# EAGLE design SHIEL_V1.0 (EAGLE 9.6.2)

## Sheet 1 of 2
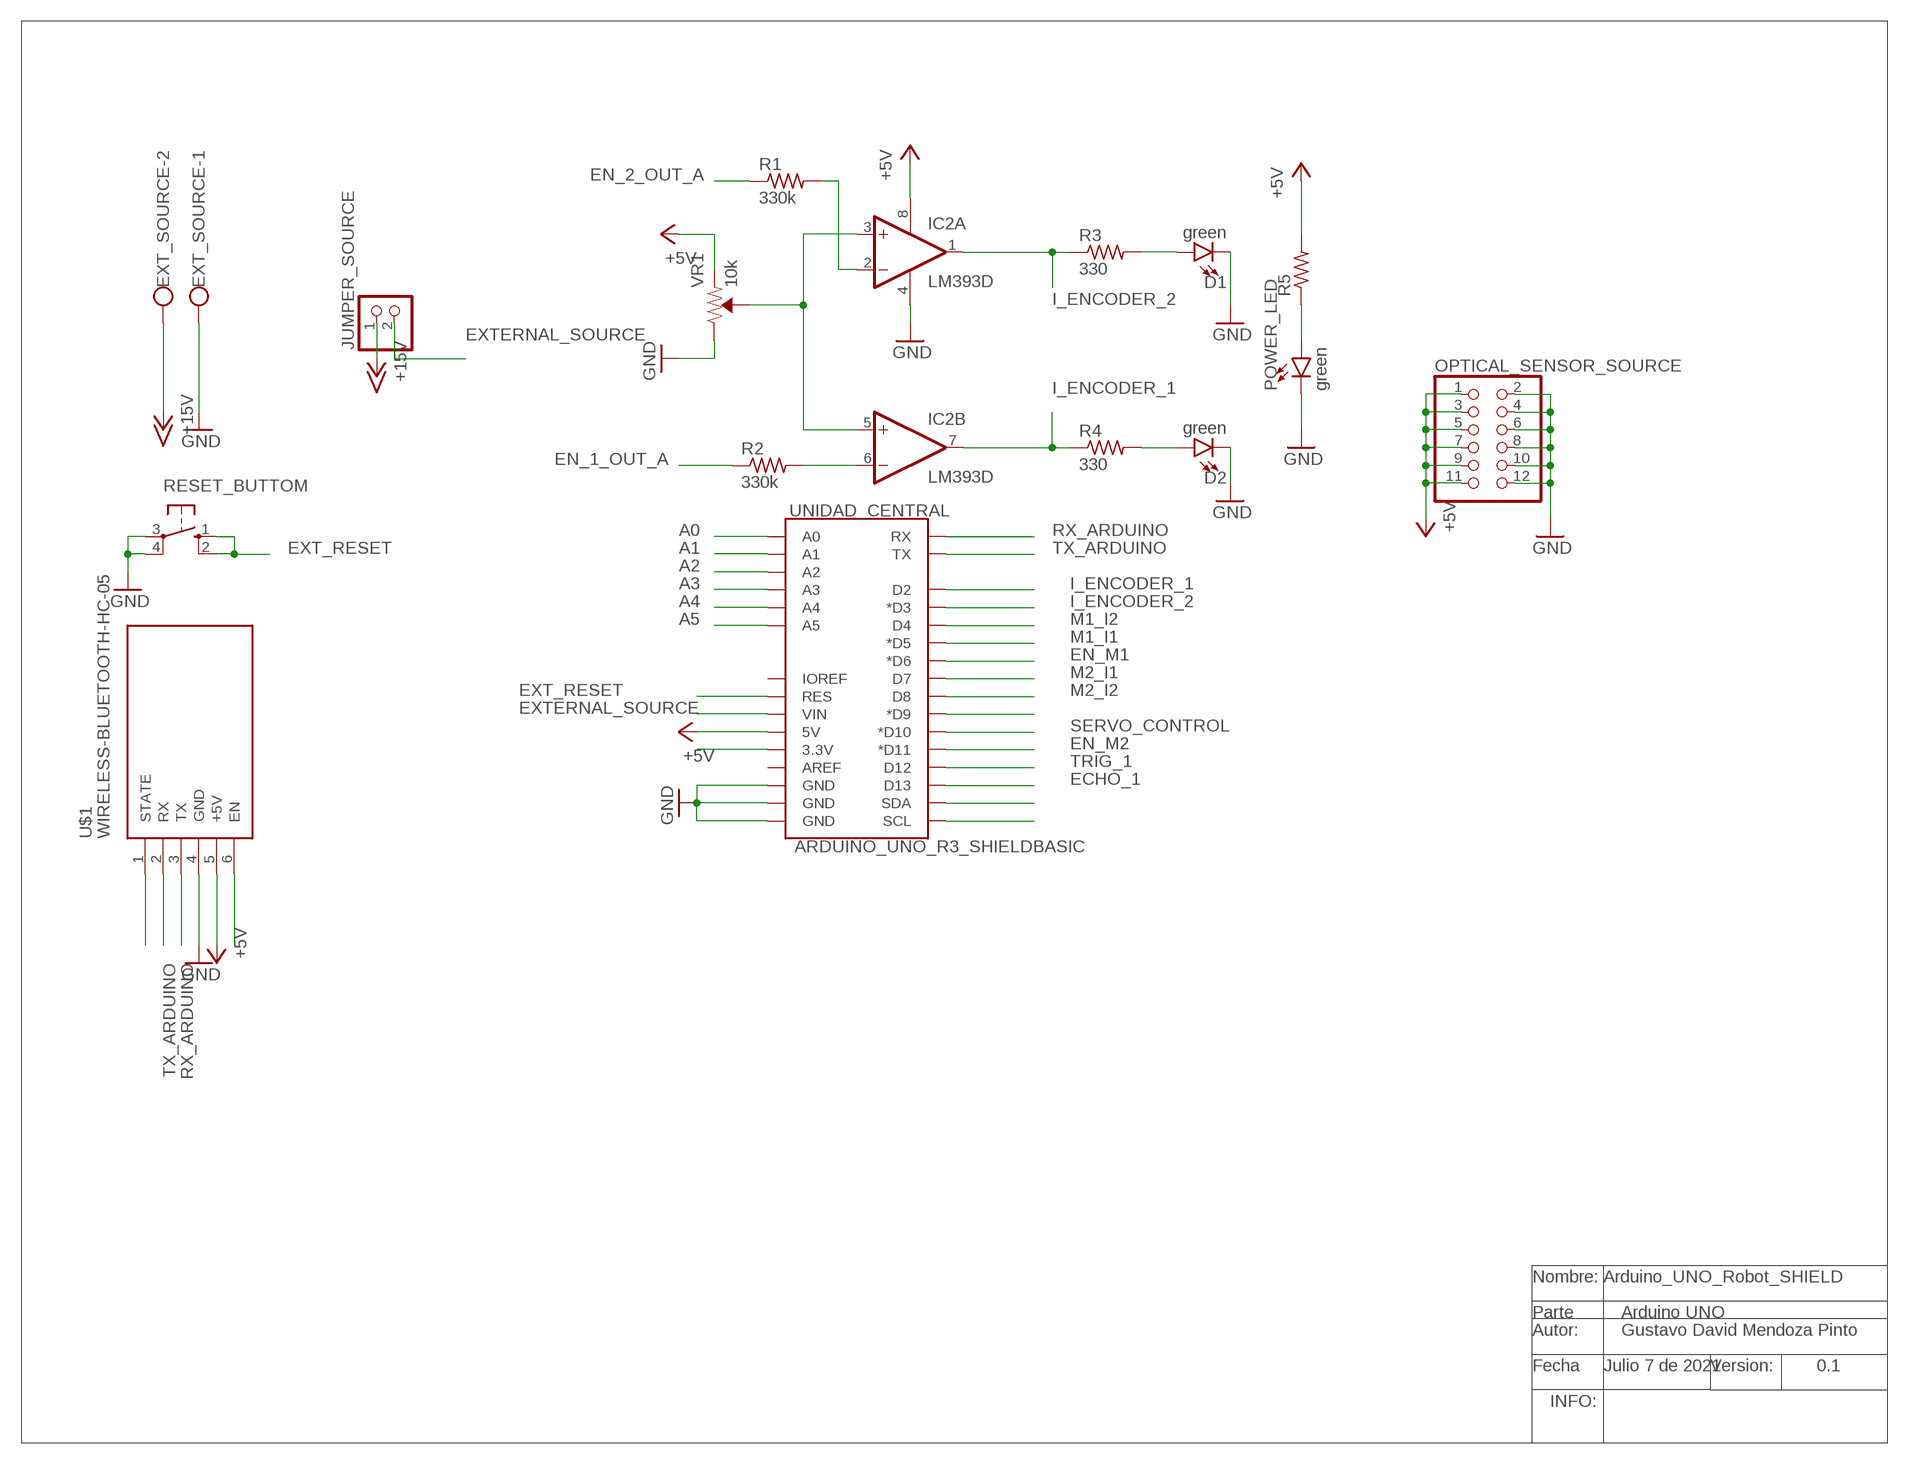
[diagram p0: schematic, sheet 1]

### Parts
D1  green  LED-3MM-NO_SILK  [LED_3MM-NS]
D2  green  LED-3MM-NO_SILK  [LED_3MM-NS]
EXT_SOURCE  W237-102  [W237-102]
IC2  LM393D  [SO08]
JUMPER_SOURCE  PINHD-1X2  [1X02]
OPTICAL_SENSOR_SOURCE  PINHD-2X6  [2X06]
POWER_LED  green  LED-3MM-NO_SILK  [LED_3MM-NS]
R1  330k  R-US_M2012  [M2012]
R2  330k  R-US_M2012  [M2012]
R3  330  R-US_M2012  [M2012]
R4  330  R-US_M2012  [M2012]
R5  R-US_M2012  [M2012]
RESET_BUTTOM  10-XX  [B3F-10XX]
U$1  WIRELESS-BLUETOOTH-HC-05  [WIRELESS-BLUETOOTH-HC-05]
UNIDAD_CENTRAL  ARDUINO_UNO_R3_SHIELDBASIC  [UNO_R3_SHIELD]
VR1  10k  TRIMPOT-PTH-10MM-KNOB-1/2W-10%  [TRIMPOT-PTH-3386U]

### Nets
+5V: IC2.8(P:V+) OPTICAL_SENSOR_SOURCE.1 OPTICAL_SENSOR_SOURCE.3 OPTICAL_SENSOR_SOURCE.5 OPTICAL_SENSOR_SOURCE.7 OPTICAL_SENSOR_SOURCE.9 OPTICAL_SENSOR_SOURCE.11 R5.2 U$1.5(+5V) UNIDAD_CENTRAL.5V VR1.1(CCW) ; also sheet 2
+15V: EXT_SOURCE.2 JUMPER_SOURCE.1
A0: UNIDAD_CENTRAL.A0 ; also sheet 2
A1: UNIDAD_CENTRAL.A1 ; also sheet 2
A2: UNIDAD_CENTRAL.A2 ; also sheet 2
A3: UNIDAD_CENTRAL.A3 ; also sheet 2
A4: UNIDAD_CENTRAL.A4 ; also sheet 2
A5: UNIDAD_CENTRAL.A5 ; also sheet 2
ECHO_1: UNIDAD_CENTRAL.D13 ; also sheet 2
EN_1_OUT_A: R2.1 ; also sheet 2
EN_2_OUT_A: R1.1 ; also sheet 2
EN_M1: UNIDAD_CENTRAL.D6(*D6) ; also sheet 2
EN_M2: UNIDAD_CENTRAL.D11(*D11) ; also sheet 2
EXT_RESET: RESET_BUTTOM.1(S) RESET_BUTTOM.2(S1) UNIDAD_CENTRAL.RES
EXTERNAL_SOURCE: JUMPER_SOURCE.2 UNIDAD_CENTRAL.VIN ; also sheet 2
GND: D1.K(C) D2.K(C) EXT_SOURCE.1 IC2.4(P:V-) OPTICAL_SENSOR_SOURCE.2 OPTICAL_SENSOR_SOURCE.4 OPTICAL_SENSOR_SOURCE.6 OPTICAL_SENSOR_SOURCE.8 OPTICAL_SENSOR_SOURCE.10 OPTICAL_SENSOR_SOURCE.12 POWER_LED.K(C) RESET_BUTTOM.3(P) RESET_BUTTOM.4(P1) U$1.4(GND) UNIDAD_CENTRAL.GND@0(GND) UNIDAD_CENTRAL.GND@1(GND) UNIDAD_CENTRAL.GND@2(GND) VR1.3(CW) ; also sheet 2
I_ENCODER_1: IC2.7(B:OUT) R4.1 UNIDAD_CENTRAL.D2 ; also sheet 2
I_ENCODER_2: IC2.1(A:OUT) R3.1 UNIDAD_CENTRAL.D3(*D3) ; also sheet 2
M1_I1: UNIDAD_CENTRAL.D5(*D5) ; also sheet 2
M1_I2: UNIDAD_CENTRAL.D4 ; also sheet 2
M2_I1: UNIDAD_CENTRAL.D7 ; also sheet 2
M2_I2: UNIDAD_CENTRAL.D8 ; also sheet 2
N$1: U$1.6(EN)
N$3: IC2.3(A:+IN) IC2.5(B:+IN) VR1.2(WIPER)
N$4: U$1.1(STATE)
N$5: UNIDAD_CENTRAL.D9(*D9)
N$6: IC2.2(A:-IN) R1.2
N$8: IC2.6(B:-IN) R2.2
N$10: POWER_LED.A R5.1
N$12: D1.A R3.2
N$13: D2.A R4.2
N$15: UNIDAD_CENTRAL.SDA
N$16: UNIDAD_CENTRAL.SCL
N$20: UNIDAD_CENTRAL.3.3V
RX_ARDUINO: U$1.3(TX) UNIDAD_CENTRAL.RX
SERVO_CONTROL: UNIDAD_CENTRAL.D10(*D10) ; also sheet 2
TRIG_1: UNIDAD_CENTRAL.D12 ; also sheet 2
TX_ARDUINO: U$1.2(RX) UNIDAD_CENTRAL.TX
Unconnected: UNIDAD_CENTRAL.AREF UNIDAD_CENTRAL.IOREF

### Notes on the sheet
- Nombre: Arduino_UNO_Robot_SHIELD
- Parte | Arduino UNO
- Autor: | Gustavo David Mendoza Pinto
- Fecha | Julio 7 de 2021 | Version: | 0.1
- INFO:

## Sheet 2 of 2
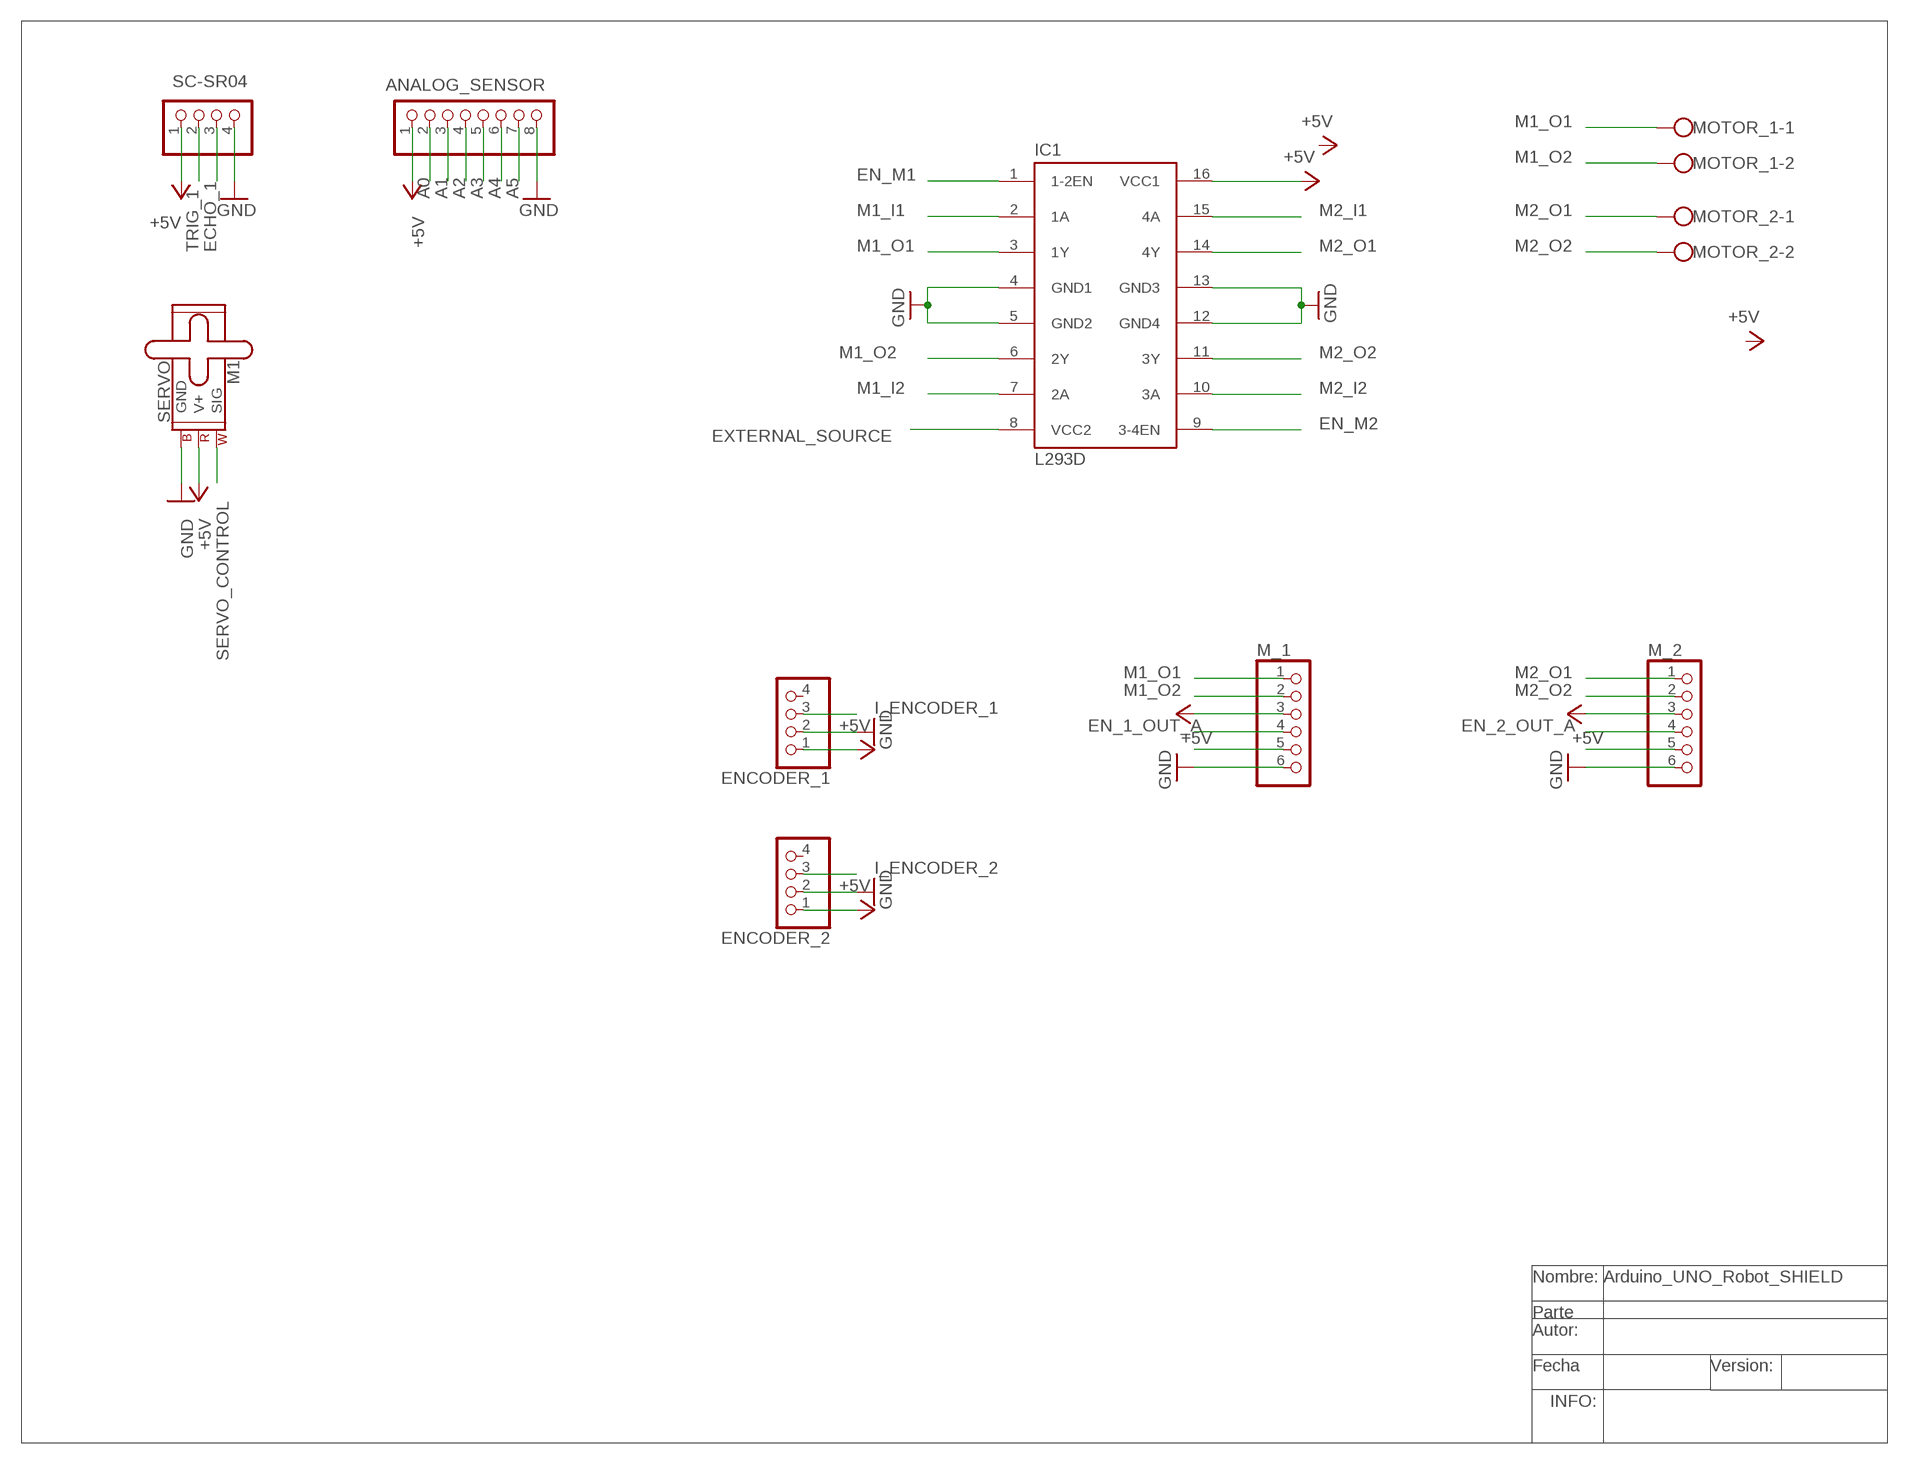
[diagram p1: schematic, sheet 2]

### Parts
ANALOG_SENSOR  PINHD-1X8  [1X08]
ENCODER_1  PINHD-1X4  [1X04]
ENCODER_2  PINHD-1X4  [1X04]
IC1  L293D  [DIL16]
M1  SERVO  [1X03]
M_1  PINHD-1X6  [1X06]
M_2  PINHD-1X6  [1X06]
MOTOR_1  W237-102  [W237-102]
MOTOR_2  W237-102  [W237-102]
SC-SR04  PINHD-1X4  [1X04]

### Nets
+5V: ANALOG_SENSOR.1 ENCODER_1.1 ENCODER_2.1 IC1.16(VCC1) M1.2(V+) M_1.3 M_2.3 SC-SR04.1 ; also sheet 1
A0: ANALOG_SENSOR.2 ; also sheet 1
A1: ANALOG_SENSOR.3 ; also sheet 1
A2: ANALOG_SENSOR.4 ; also sheet 1
A3: ANALOG_SENSOR.5 ; also sheet 1
A4: ANALOG_SENSOR.6 ; also sheet 1
A5: ANALOG_SENSOR.7 ; also sheet 1
ECHO_1: SC-SR04.3 ; also sheet 1
EN_1_OUT_A: M_1.4 ; also sheet 1
EN_2_OUT_A: M_2.4 ; also sheet 1
EN_M1: IC1.1(1-2EN) ; also sheet 1
EN_M2: IC1.9(3-4EN) ; also sheet 1
EXTERNAL_SOURCE: IC1.8(VCC2) ; also sheet 1
GND: ANALOG_SENSOR.8 ENCODER_1.2 ENCODER_2.2 IC1.4(GND1) IC1.5(GND2) IC1.12(GND4) IC1.13(GND3) M1.3(GND) M_1.6 M_2.6 SC-SR04.4 ; also sheet 1
I_ENCODER_1: ENCODER_1.3 ; also sheet 1
I_ENCODER_2: ENCODER_2.3 ; also sheet 1
M1_I1: IC1.2(1A) ; also sheet 1
M1_I2: IC1.7(2A) ; also sheet 1
M1_O1: IC1.3(1Y) M_1.1 MOTOR_1.1
M1_O2: IC1.6(2Y) M_1.2 MOTOR_1.2
M2_I1: IC1.15(4A) ; also sheet 1
M2_I2: IC1.10(3A) ; also sheet 1
M2_O1: IC1.14(4Y) M_2.1 MOTOR_2.1
M2_O2: IC1.11(3Y) M_2.2 MOTOR_2.2
N$46: M_1.5
N$52: M_2.5
SERVO_CONTROL: M1.1(SIG) ; also sheet 1
TRIG_1: SC-SR04.2 ; also sheet 1
Unconnected: ENCODER_1.4 ENCODER_2.4

### Notes on the sheet
- Nombre: Arduino_UNO_Robot_SHIELD
- Parte
- Autor:
- Fecha | Version:
- INFO:

## Library data of the parts
ANALOG_SENSOR = pinhead:PINHD-1X8: PIN HEADER
D1 D2 POWER_LED = SparkFun-LED:LED: LED (Generic) Standard schematic elements and footprints for 5mm, 3mm, 1206, and 0603 sized LEDs. Generic LEDs with no color specified.
ENCODER_1 ENCODER_2 SC-SR04 = pinhead:PINHD-1X4: PIN HEADER
EXT_SOURCE MOTOR_1 MOTOR_2 = con-wago-500:W237-102: WAGO SCREW CLAMP; MPN: 237-102; OC_FARNELL: unknown; OC_NEWARK: 70K9898
IC1 = st-microelectronics:L293D: PUSH-PULL 4 CHANNEL DRIVER; MPN: L293D; OC_FARNELL: 9589619; OC_NEWARK: 56P8249
IC2 = linear:LM393: COMPARATOR
JUMPER_SOURCE = pinhead:PINHD-1X2: PIN HEADER
M1 = SparkFun-Electromechanical:SERVO: Servo Motor 3-pin connector for a standard servo motor (voltage supply, ground, and control signal.) SparkFun Products Servo - Generic (Sub-Micro Size) <https://www.sparkfun.com/products/9065> (ROB-09065) Servo - Generic High Torque Continuous Rotation (Standard Size) <https://www.sparkfun.com/products/9347> (ROB-09347) Servo - Generic High Torque (Standard Size) <https://www.sparkfun.com/products/11965> (ROB-11965)
M_1 M_2 = pinhead:PINHD-1X6: PIN HEADER
OPTICAL_SENSOR_SOURCE = pinhead:PINHD-2X6: PIN HEADER
R1-R5 = rcl:R-US_: RESISTOR, American symbol; SPICEPREFIX: R
RESET_BUTTOM = switch-omron:10-XX: OMRON SWITCH; MPN: B3F-1000; OC_FARNELL: 176432; OC_NEWARK: 36M3542
U$1 = diy-modules:WIRELESS-BLUETOOTH-HC-05: Bluetooth Transceiver Module based on HC-05 board Tutorial is available here: https://arduino-info.wikispaces.com/BlueTooth-HC05-HC06-Modules-How-To Click here to find device on ebay.com <http://www.ebay.com/sch/hc-05+module+rs232>
UNIDAD_CENTRAL = SparkFun-Boards:ARDUINO_UNO_R3_SHIELD: Arduino R3 Shield Footprint Shield form compatible with the Arduino Uno R3. SparkFun Products: MG2639 Cellular Shield <https://www.sparkfun.com/products/13120> MIDI Shield <https://www.sparkfun.com/products/12898> R3 Stackable Headers Kit <https://www.sparkfun.com/products/11417>
VR1 = SparkFun-Resistors:TRIMPOT: Trimming Potentiometer (Trimpot) Three-terminal potentiometers, with an adjustable wiper and two adjustable resistors. A pot can be used to create a configurable voltage divider, or as a variable resistor. "Trimpots" are a subset of potentiometers, usually intended for "set-and-forget" applications. They're often more delicate than standard potentiometers - rated for fewer turns. Variants PTH-KNOB - PTH Trimpot w/ finger-adjustable knob Trimpot 10K with Knob <https://www.sparkfun.com/products/9806> (COM-09806) Datasheet <http://www.sparkfun.com/datasheets/Components/General/TSR-3386.pdf> SMD-3MM-CLOSED-FRAME - SMD 3mm Square Closed-Frame Trimpot Used on e.g. EasyDriver - Stepper Motor Driver <https://www.sparkfun.com/products/12779> Datasheet <http://www.bitechnologies.com/pdfs/22.pdf> (22AR10KTR) SMD-5MM - SMD 5mm Square Closed-Frame Trimpot Used on e.g. IOIO-OTG - V2.2 <https://www.sparkfun.com/products/13613> Datasheet <http://www.vishay.com/docs/51008/ts53.pdf> (TS53YL502MR10) SMD-3MM-1/10W-25% - 3mm Square Open-Frame Trimpot Used on e.g. SparkFun Shapeoko <https://www.sparkfun.com/products/13899> Datasheet <http://www.bourns.com/docs/Product-Datasheets/TC33.pdf> (TC33X-2-103E); PROD_ID: RES-09730; SF_SKU: COM-09806

## Board
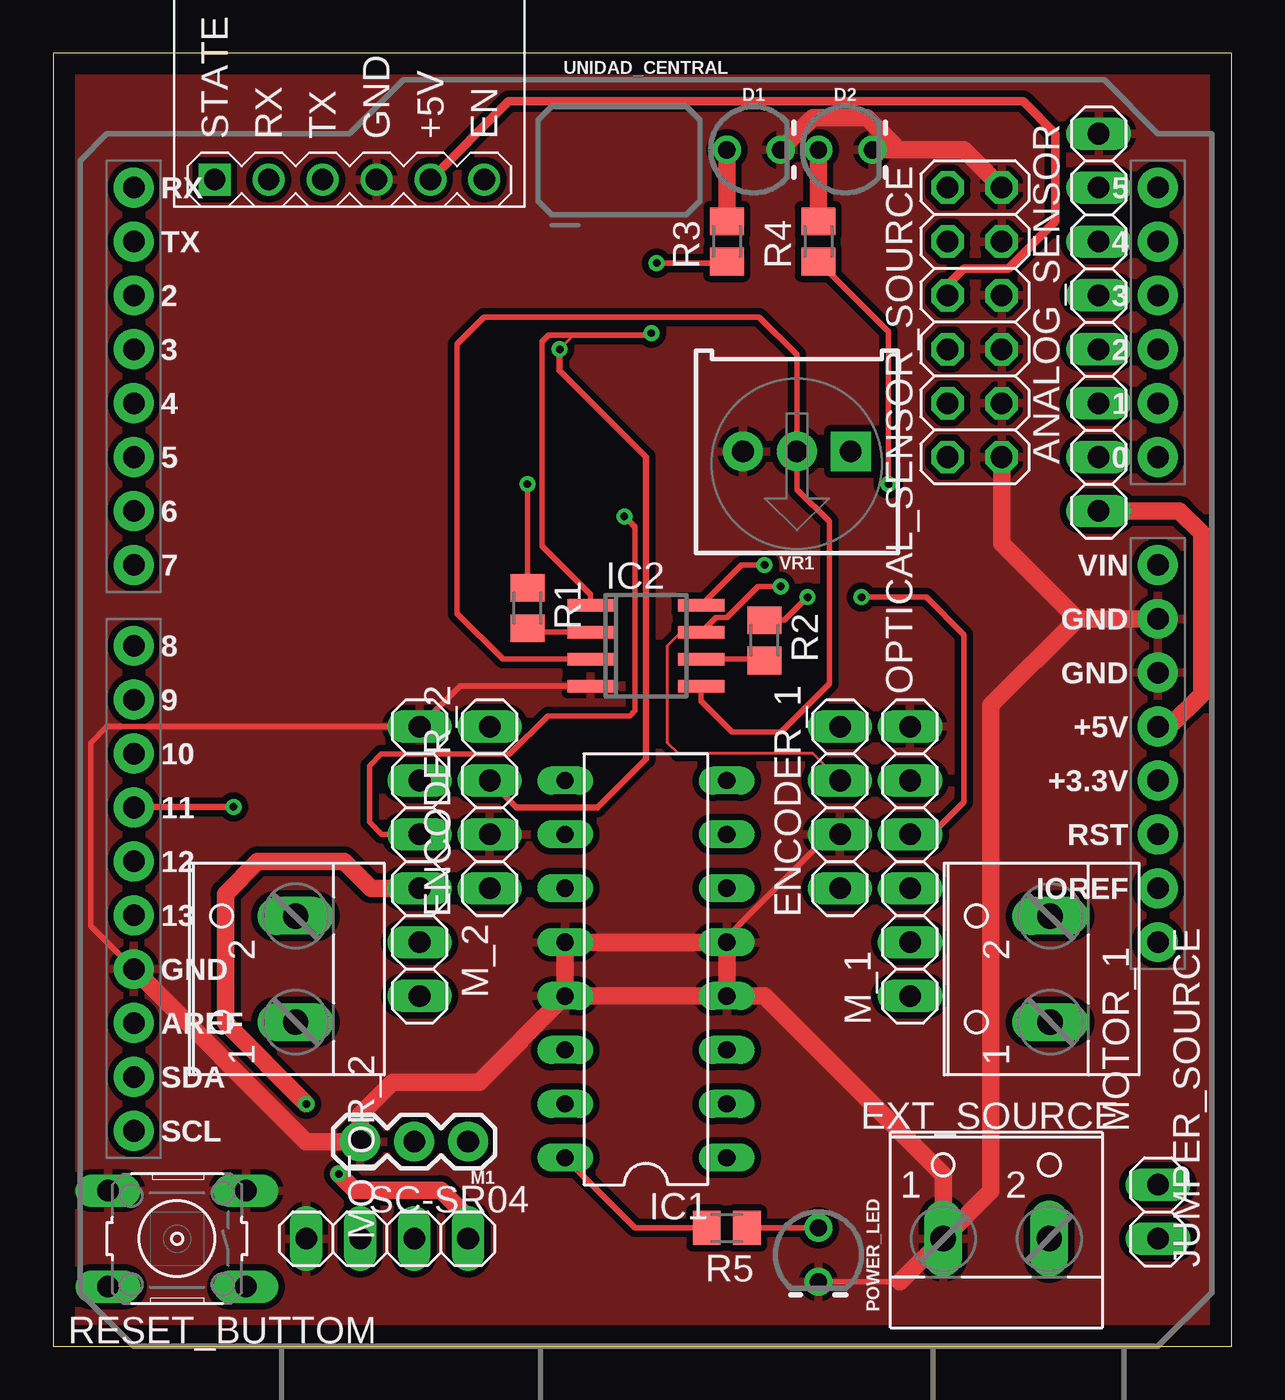
[diagram p2: board, top side]
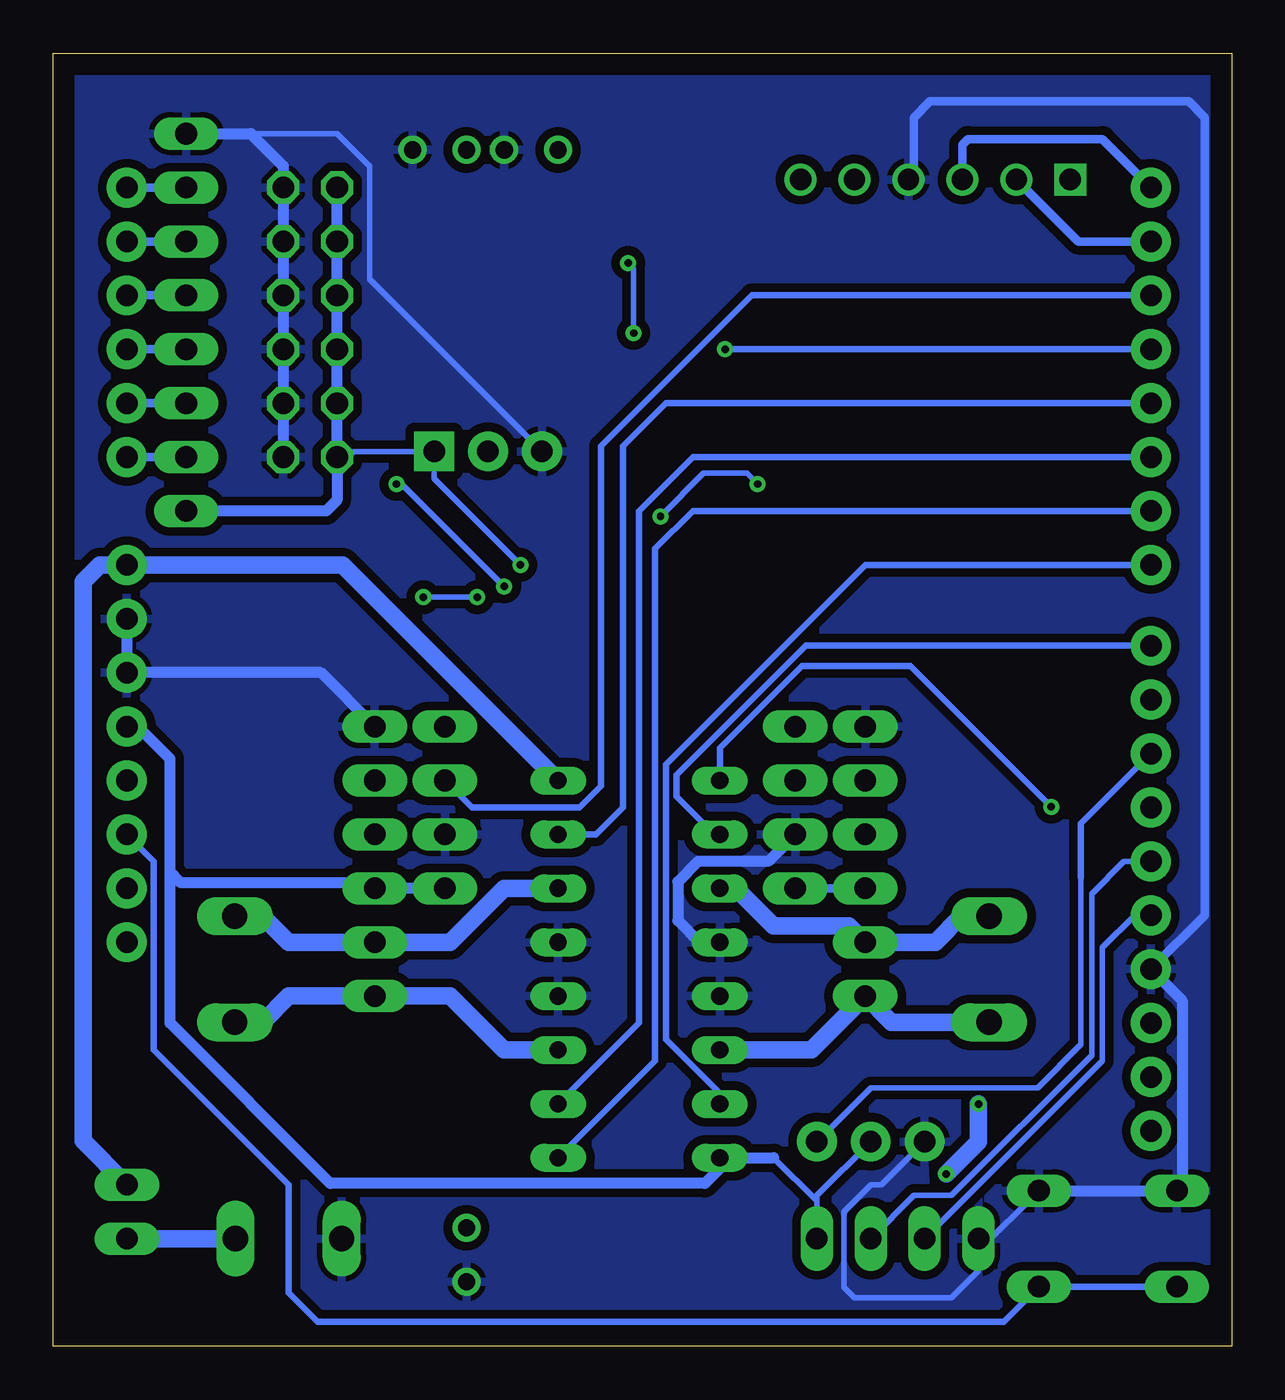
[diagram p3: board, bottom side, seen from below]

Size 55.55 x 60.95 mm. Coordinates in mm from the lower left corner, seen from the top.
Outline: 0,0 55.55,0 55.55,60.95 0,60.95 0,0
Copper layers (1*16): Top 0.035mm / dielectric 1.5mm / Bottom 0.035mm
Design rules "default": minimum track width 6mil, minimum drill 0.35mm, track to track 6mil, track to pad 6mil, pad to pad 6mil, via to via 6mil, smd to smd 6mil, copper to edge 40mil, drill to drill 6mil, minimum pad ring 10mil, minimum via ring 8mil, stop-mask expansion 4mil, vias tented up to drill 0mil, thermal gap 10mil

### Footprints (pad centres in the part's own frame; a part is rotated, then mirrored left to right if it is on the bottom)
1X08 = drill 1.016 long: 1 -8.89,0; 2 -6.35,0; 3 -3.81,0; 4 -1.27,0; 5 1.27,0; 6 3.81,0; 7 6.35,0; 8 8.89,0
LED_3MM-NS = drill 0.813: A -1.27,0; K 1.27,0
1X04 = drill 1.016 long: 1 -3.81,0; 2 -1.27,0; 3 1.27,0; 4 3.81,0
W237-102 = drill 1.194 long: 1 -2.5,-1.27; 2 2.5,-1.27
DIL16 = drill 0.813 long: 1 -8.89,-3.81; 2 -6.35,-3.81; 3 -3.81,-3.81; 4 -1.27,-3.81; 5 1.27,-3.81; 6 3.81,-3.81; 7 6.35,-3.81; 8 8.89,-3.81; 9 8.89,3.81; 10 6.35,3.81; 11 3.81,3.81; 12 1.27,3.81; 13 -1.27,3.81; 14 -3.81,3.81; 15 -6.35,3.81; 16 -8.89,3.81
SO08 = smd 0.6 x 2.2: 1 -1.905,-2.6; 2 -0.635,-2.6; 3 0.635,-2.6; 4 1.905,-2.6; 5 1.905,2.6; 6 0.635,2.6; 7 -0.635,2.6; 8 -1.905,2.6
1X02 = drill 1.016 long: 1 -1.27,0; 2 1.27,0
1X03 = drill 1.016 pad 1.88: 1 0,0; 2 2.54,0; 3 5.08,0
1X06 = drill 1.016 long: 1 -6.35,0; 2 -3.81,0; 3 -1.27,0; 4 1.27,0; 5 3.81,0; 6 6.35,0
2X06 = drill 1.016 octagon: 1 -6.35,-1.27; 2 -6.35,1.27; 3 -3.81,-1.27; 4 -3.81,1.27; 5 -1.27,-1.27; 6 -1.27,1.27; 7 1.27,-1.27; 8 1.27,1.27; 9 3.81,-1.27; 10 3.81,1.27; 11 6.35,-1.27; 12 6.35,1.27
M2012 = smd 1.3 x 1.6: 1 -0.95,0; 2 0.95,0
B3F-10XX = drill 1.016 long: 1 -3.251,2.261; 2 3.251,2.261; 3 -3.251,-2.261; 4 3.251,-2.261
WIRELESS-BLUETOOTH-HC-05 = drill 1 square: 1 -6.35,-17.145 | drill 1: 2 -3.81,-17.145; 3 -1.27,-17.145; 4 1.27,-17.145; 5 3.81,-17.145; 6 6.35,-17.145
UNO_R3_SHIELD = drill 1.016 pad 1.88: 3.3V 24.13,-2.54; 5V 24.13,0; A0 24.13,12.7; A1 24.13,15.24; A2 24.13,17.78; A3 24.13,20.32; A4 24.13,22.86; A5 24.13,25.4; AREF -24.13,-13.97; D2 -24.13,20.32; D3 -24.13,17.78; D4 -24.13,15.24; D5 -24.13,12.7; D6 -24.13,10.16; D7 -24.13,7.62; D8 -24.13,3.81; D9 -24.13,1.27; D10 -24.13,-1.27; D11 -24.13,-3.81; D12 -24.13,-6.35; D13 -24.13,-8.89; GND@0 24.13,2.54; GND@1 24.13,5.08; GND@2 -24.13,-11.43; IOREF 24.13,-7.62; NC 24.13,-10.16; RES 24.13,-5.08; RX -24.13,25.4; SCL -24.13,-19.05; SDA -24.13,-16.51; TX -24.13,22.86; VIN 24.13,7.62
TRIMPOT-PTH-3386U = drill 1.016 pad 1.88 square: 1 -2.54,-0.015 | drill 1.016 pad 1.88: 2 0,-0.015; 3 2.54,-0.015

### Placement (x,y rotation side)
ANALOG_SENSOR  49.28,48.26 90 top
D1  33.02,56.39 0 top
D2  37.34,56.39 0 top
ENCODER_1  37.08,25.4 90 top
ENCODER_2  20.57,25.4 90 top
EXT_SOURCE  44.45,6.35 0 top
IC1  27.94,17.78 90 top
IC2  27.94,33.02 270 top
JUMPER_SOURCE  52.07,6.35 90 top
M1  19.56,9.65 180 top
M_1  40.39,22.86 90 top
M_2  17.27,22.86 90 top
MOTOR_1  45.72,17.78 90 top
MOTOR_2  10.16,17.78 90 top
OPTICAL_SENSOR_SOURCE  43.43,48.26 270 top
POWER_LED  36.07,4.32 270 top
R1  22.35,34.8 270 top
R2  33.53,33.27 270 top
R3  31.75,52.07 90 top
R4  36.07,52.07 90 top
R5  31.75,5.59 180 top
RESET_BUTTOM  5.84,5.08 180 top
SC-SR04  15.75,5.08 180 top
U$1  13.97,72.14 0 top
UNIDAD_CENTRAL  27.94,29.21 0 top
VR1  35.05,42.16 180 top

### Tracks (layer width: path | path; a pad name or v marks a point on that pad's centre or on a via)
+5V  (via drill 0.35)
  Top 0.254: IC2.8 32.45,36.83 v33.53,36.83 | IC1.16 27.43,5.59 R5.2
  Top 0.406: U$1.5 21.46,58.67 45.72,58.67 47.24,57.15 47.24,53.03 45.02,50.8 42.93,50.8 42.16,50.04 OPTICAL_SENSOR_SOURCE.5
  Top 0.813: M_2.3 14.99,21.59 13.72,22.86 9.65,22.86 8.13,21.34 8.13,15.24 v11.94,11.43 | v13.46,8.13 14.22,7.37 18.29,7.37 19.56,6.1 SC-SR04.1 | UNIDAD_CENTRAL.5V 52.6,29.21 54.13,30.73 54.13,38.33 53.09,39.37 ANALOG_SENSOR.1
  Bottom 0.254: 21.59,8.89 19.56,6.86 | 19.56,6.86 SC-SR04.1 | M1.2 19.56,7.11 19.56,6.86 | 42.16,41.4 41.39,42.18 VR1.1 37.59,40.89 v33.53,36.83
  Bottom 0.406: ENCODER_2.1 M_2.3
  Bottom 0.508: 50.04,22.35 50.04,15.24 42.48,7.68 24.83,7.68 24.13,8.38 IC1.16 21.59,8.89 | 50.04,22.35 50.04,27.69 51.56,29.21 UNIDAD_CENTRAL.5V | ANALOG_SENSOR.1 42.67,39.37 42.16,39.88 42.16,41.4 OPTICAL_SENSOR_SOURCE.11 OPTICAL_SENSOR_SOURCE.9 OPTICAL_SENSOR_SOURCE.7 OPTICAL_SENSOR_SOURCE.5 OPTICAL_SENSOR_SOURCE.3 OPTICAL_SENSOR_SOURCE.1 | ENCODER_1.1 M_1.3 40.64,21.84 49.53,21.84 50.04,22.35
  Bottom 0.813: v11.94,11.43 11.94,9.65 v13.46,8.13
+15V
  Bottom 0.813: EXT_SOURCE.2 JUMPER_SOURCE.1
A0
  Bottom 0.406: ANALOG_SENSOR.2 UNIDAD_CENTRAL.A0
A1
  Bottom 0.406: ANALOG_SENSOR.3 UNIDAD_CENTRAL.A1
A2
  Bottom 0.406: ANALOG_SENSOR.4 UNIDAD_CENTRAL.A2
A3
  Bottom 0.406: ANALOG_SENSOR.5 UNIDAD_CENTRAL.A3
A4
  Bottom 0.406: ANALOG_SENSOR.6 UNIDAD_CENTRAL.A4
A5
  Bottom 0.406: ANALOG_SENSOR.7 UNIDAD_CENTRAL.A5
ECHO_1
  Bottom 0.254: UNIDAD_CENTRAL.D13 4.57,20.32 6.1,18.8 6.1,13.46 SC-SR04.3
EN_1_OUT_A  (via drill 0.35)
  Top 0.254: M_1.4 41.4,24.13 42.93,25.65 42.93,33.53 41.15,35.31 v38.1,35.31 | v35.56,35.31 34.48,34.22 R2.1
  Bottom 0.254: v38.1,35.31 v35.56,35.31
EN_2_OUT_A  (via drill 0.35)
  Top 0.254: M_2.4 15.49,24.13 14.91,24.71 14.91,27.36 15.47,27.91 21.51,27.91 23.32,29.72 27.18,29.72 27.43,29.97 27.43,38.61 v26.92,39.12 | v22.35,40.64 R1.1
  Bottom 0.254: v26.92,39.12 24.89,41.15 22.86,41.15 v22.35,40.64
EN_M1
  Bottom 0.305: IC1.1 27.18,13.46 27.18,37.59 25.4,39.37 UNIDAD_CENTRAL.D6
EN_M2  (via drill 0.35)
  Top 0.305: v8.51,25.43 3.83,25.43 UNIDAD_CENTRAL.D11
  Bottom 0.305: IC1.9 24.13,28.19 20.27,32.05 15.14,32.05 v8.51,25.43
EXT_RESET
  Bottom 0.305: RESET_BUTTOM.2 RESET_BUTTOM.1 10.74,1.17 43.08,1.17 44.45,2.54 44.45,7.62 50.8,13.97 50.8,22.86 UNIDAD_CENTRAL.RES
EXTERNAL_SOURCE
  Bottom 0.813: JUMPER_SOURCE.2 54.13,9.68 54.13,36.04 53.34,36.83 UNIDAD_CENTRAL.VIN 41.91,36.83 IC1.8
GND
  Top 0.254: IC2.4 19.18,31.11 M_2.6 2.54,29.21 1.78,28.45 1.78,19.81 UNIDAD_CENTRAL.GND@2 | IC1.5 31.75,19.3 36.58,24.13 ENCODER_1.2 | POWER_LED.K 39.92,3.05
  Top 0.813: IC1.13 20.07,12.45 16,12.45 14.48,10.92 M1.3 11.94,9.65 UNIDAD_CENTRAL.GND@2 | 39.92,3.05 EXT_SOURCE.1 | EXT_SOURCE.1 41.95,8.09 33.53,16.51 IC1.4 | IC1.4 IC1.5 IC1.12 IC1.13 | IC1.13 IC1.4 | UNIDAD_CENTRAL.GND@1 48.26,34.29 | 48.26,34.29 44.2,30.23 44.2,7.33 EXT_SOURCE.1 | D2.K 39.62,56.39 | 39.62,56.39 42.93,56.39 OPTICAL_SENSOR_SOURCE.2 | D1.K 35.81,57.91 38.35,57.91 39.62,56.64 39.62,56.39 | OPTICAL_SENSOR_SOURCE.12 44.7,37.85 48.26,34.29
  Bottom 0.254: M1.3 16.51,7.62 17.02,7.62 18.29,6.35 18.29,2.79 17.78,2.29 13.21,2.29 11.94,3.56 11.94,4.5 | 11.94,4.5 SC-SR04.4 | RESET_BUTTOM.3 11.94,4.5 | VR1.3 40.64,50.31 40.64,55.63 42.16,57.15 46.23,57.15
  Bottom 0.305: RESET_BUTTOM.4 8.89,7.34 RESET_BUTTOM.3
  Bottom 0.406: U$1.4 14.99,55.24 14.99,57.91 14.22,58.67 2.03,58.67 1.27,57.91 1.27,20.32 UNIDAD_CENTRAL.GND@2
  Bottom 0.508: UNIDAD_CENTRAL.GND@2 2.34,16.31 2.34,7.59 RESET_BUTTOM.4 RESET_BUTTOM.3 | ANALOG_SENSOR.8 46.23,57.15 44.7,55.63 OPTICAL_SENSOR_SOURCE.2 OPTICAL_SENSOR_SOURCE.4 OPTICAL_SENSOR_SOURCE.6 OPTICAL_SENSOR_SOURCE.8 OPTICAL_SENSOR_SOURCE.10 OPTICAL_SENSOR_SOURCE.12 | 8.89,7.37 8.89,7.34 | M1.3 14.45,9.63 | M_1.6 42.93,31.75 UNIDAD_CENTRAL.GND@0 UNIDAD_CENTRAL.GND@1 | ENCODER_2.2 21.84,22.86 25.15,22.86 26.11,21.89 26.11,20.07 25.09,19.05 IC1.12
  pour Bottom (isolate 0.406): 0,0 55.37,0 55.37,60.71 0.25,60.71 0,60.45
  pour Top (isolate 0.305): 0.25,0 55.37,0 55.37,60.71 0.25,60.71
I_ENCODER_1  (via drill 0.35)
  Top 0.152: ENCODER_1.3 35.81,27.94 29.46,27.94 28.96,28.45 28.96,33.02 29.72,33.78 30.48,33.78 30.57,33.69
  Top 0.254: IC2.7 30.57,33.69 31.23,34.35 31.76,34.35 33.22,35.81 v34.29,35.81 | v39.37,40.64 39.37,47.82 R4.1
  Bottom 0.254: v34.29,35.81 39.12,40.64 v39.37,40.64
  Bottom 0.305: UNIDAD_CENTRAL.D2 22.61,49.53 29.72,42.42 29.72,26.42 30.73,25.4 35.81,25.4 ENCODER_1.3
I_ENCODER_2  (via drill 0.35)
  Top 0.152: v23.88,46.99 24.53,47.65 28.09,47.65
  Top 0.254: IC2.1 25.34,35.43 23.05,37.72 23.05,47.35 23.35,47.65 28.09,47.65 v28.19,47.75 | v28.45,51.05 31.68,51.05 R3.1
  Top 0.305: ENCODER_2.3 21.84,25.4 25.65,25.4 27.94,27.69 27.94,41.91 23.88,45.97 v23.88,46.99
  Bottom 0.254: v28.19,47.75 28.19,50.8 v28.45,51.05
  Bottom 0.305: v23.88,46.99 UNIDAD_CENTRAL.D3
M1_I1
  Bottom 0.305: IC1.2 27.94,15.24 27.94,39.37 25.4,41.91 UNIDAD_CENTRAL.D5
M1_I2
  Bottom 0.305: IC1.7 29.97,24.13 28.7,25.4 28.7,42.42 26.67,44.45 UNIDAD_CENTRAL.D4
M1_O1
  Bottom 0.813: IC1.3 34.29,13.97 36.83,16.51 M_1.1 44.45,16.51 45.68,15.28 MOTOR_1.1
M1_O2
  Bottom 0.813: IC1.6 34.29,21.59 36.83,19.05 M_1.2 44.45,19.05 45.72,20.32 46.95,20.32 MOTOR_1.2
M2_I1
  Bottom 0.305: IC1.15 24.13,11.94 26.67,14.48 26.67,27.43 17.27,36.83 UNIDAD_CENTRAL.D7
M2_I2
  Bottom 0.305: IC1.10 24.38,24.13 26.16,25.91 26.16,26.92 20.07,33.02 UNIDAD_CENTRAL.D8
M2_O1
  Bottom 0.813: IC1.14 19.81,13.97 M_2.1 16.04,15.28 MOTOR_2.1
M2_O2
  Bottom 0.813: MOTOR_2.2 12.74,20.28 13.97,19.05 M_2.2 18.03,19.81 21.59,19.81 23.37,21.59 IC1.11
N$3
  Top 0.254: IC2.5 30.54,30.42 32,28.96 34.29,28.96 36.58,31.24 36.58,38.86 35.05,40.39 VR1.2 35.05,46.74 33.27,48.51 20.32,48.51 19.05,47.24 19.05,34.54 21.21,32.38 IC2.3
N$6
  Top 0.254: IC2.2 22.55,33.66 R1.2
N$8
  Top 0.254: IC2.6 33.47,32.38 R2.2
N$10
  Top 0.254: R5.1 POWER_LED.A
N$12
  Top 0.813: R3.2 D1.A
N$13
  Top 0.813: R4.2 D2.A
RX_ARDUINO
  Bottom 0.406: U$1.3 12.7,56.64 12.45,56.9 6.1,56.9 UNIDAD_CENTRAL.RX
SERVO_CONTROL
  Bottom 0.254: 7.11,22.1 7.11,14.22 9.14,12.19 17.02,12.19 M1.1
  Bottom 0.305: 7.11,22.1 7.11,24.64 UNIDAD_CENTRAL.D10
TRIG_1
  Bottom 0.254: UNIDAD_CENTRAL.D12 5.08,22.86 6.6,21.34 6.6,13.72 13.21,7.11 14.99,7.11 SC-SR04.2
TX_ARDUINO
  Bottom 0.406: U$1.2 7.24,52.07 UNIDAD_CENTRAL.TX

### Text on the board
tDocu: 5V | GND | 5v | Robot Shield | Taller de Robótica | UNITEC | + | - | GND | - | + | +VSS
bDocu: UNITEC / Taller de Robotica / Robot - Shield GDMP
201bmp: /Users/gustavomendoza/Desktop/Iconbw.bmp